# Altium schematic sheet EVB-NORA-B2_SCHEM_0000_Topsheet.SchDoc
size A3; Date: 7/24/2020; CompanyName: U-Blox; DrawnBy: EMOO; Engineer: EMOO; Organization: U-Blox; Address1: 3950 Fairview Industrial Dr SE #100; Address2: Salem, OR 97302; DocumentNumber: 1; SheetNumber: 1; SheetTotal: 8; SheetSize: B; SheetTitle: TopSheet
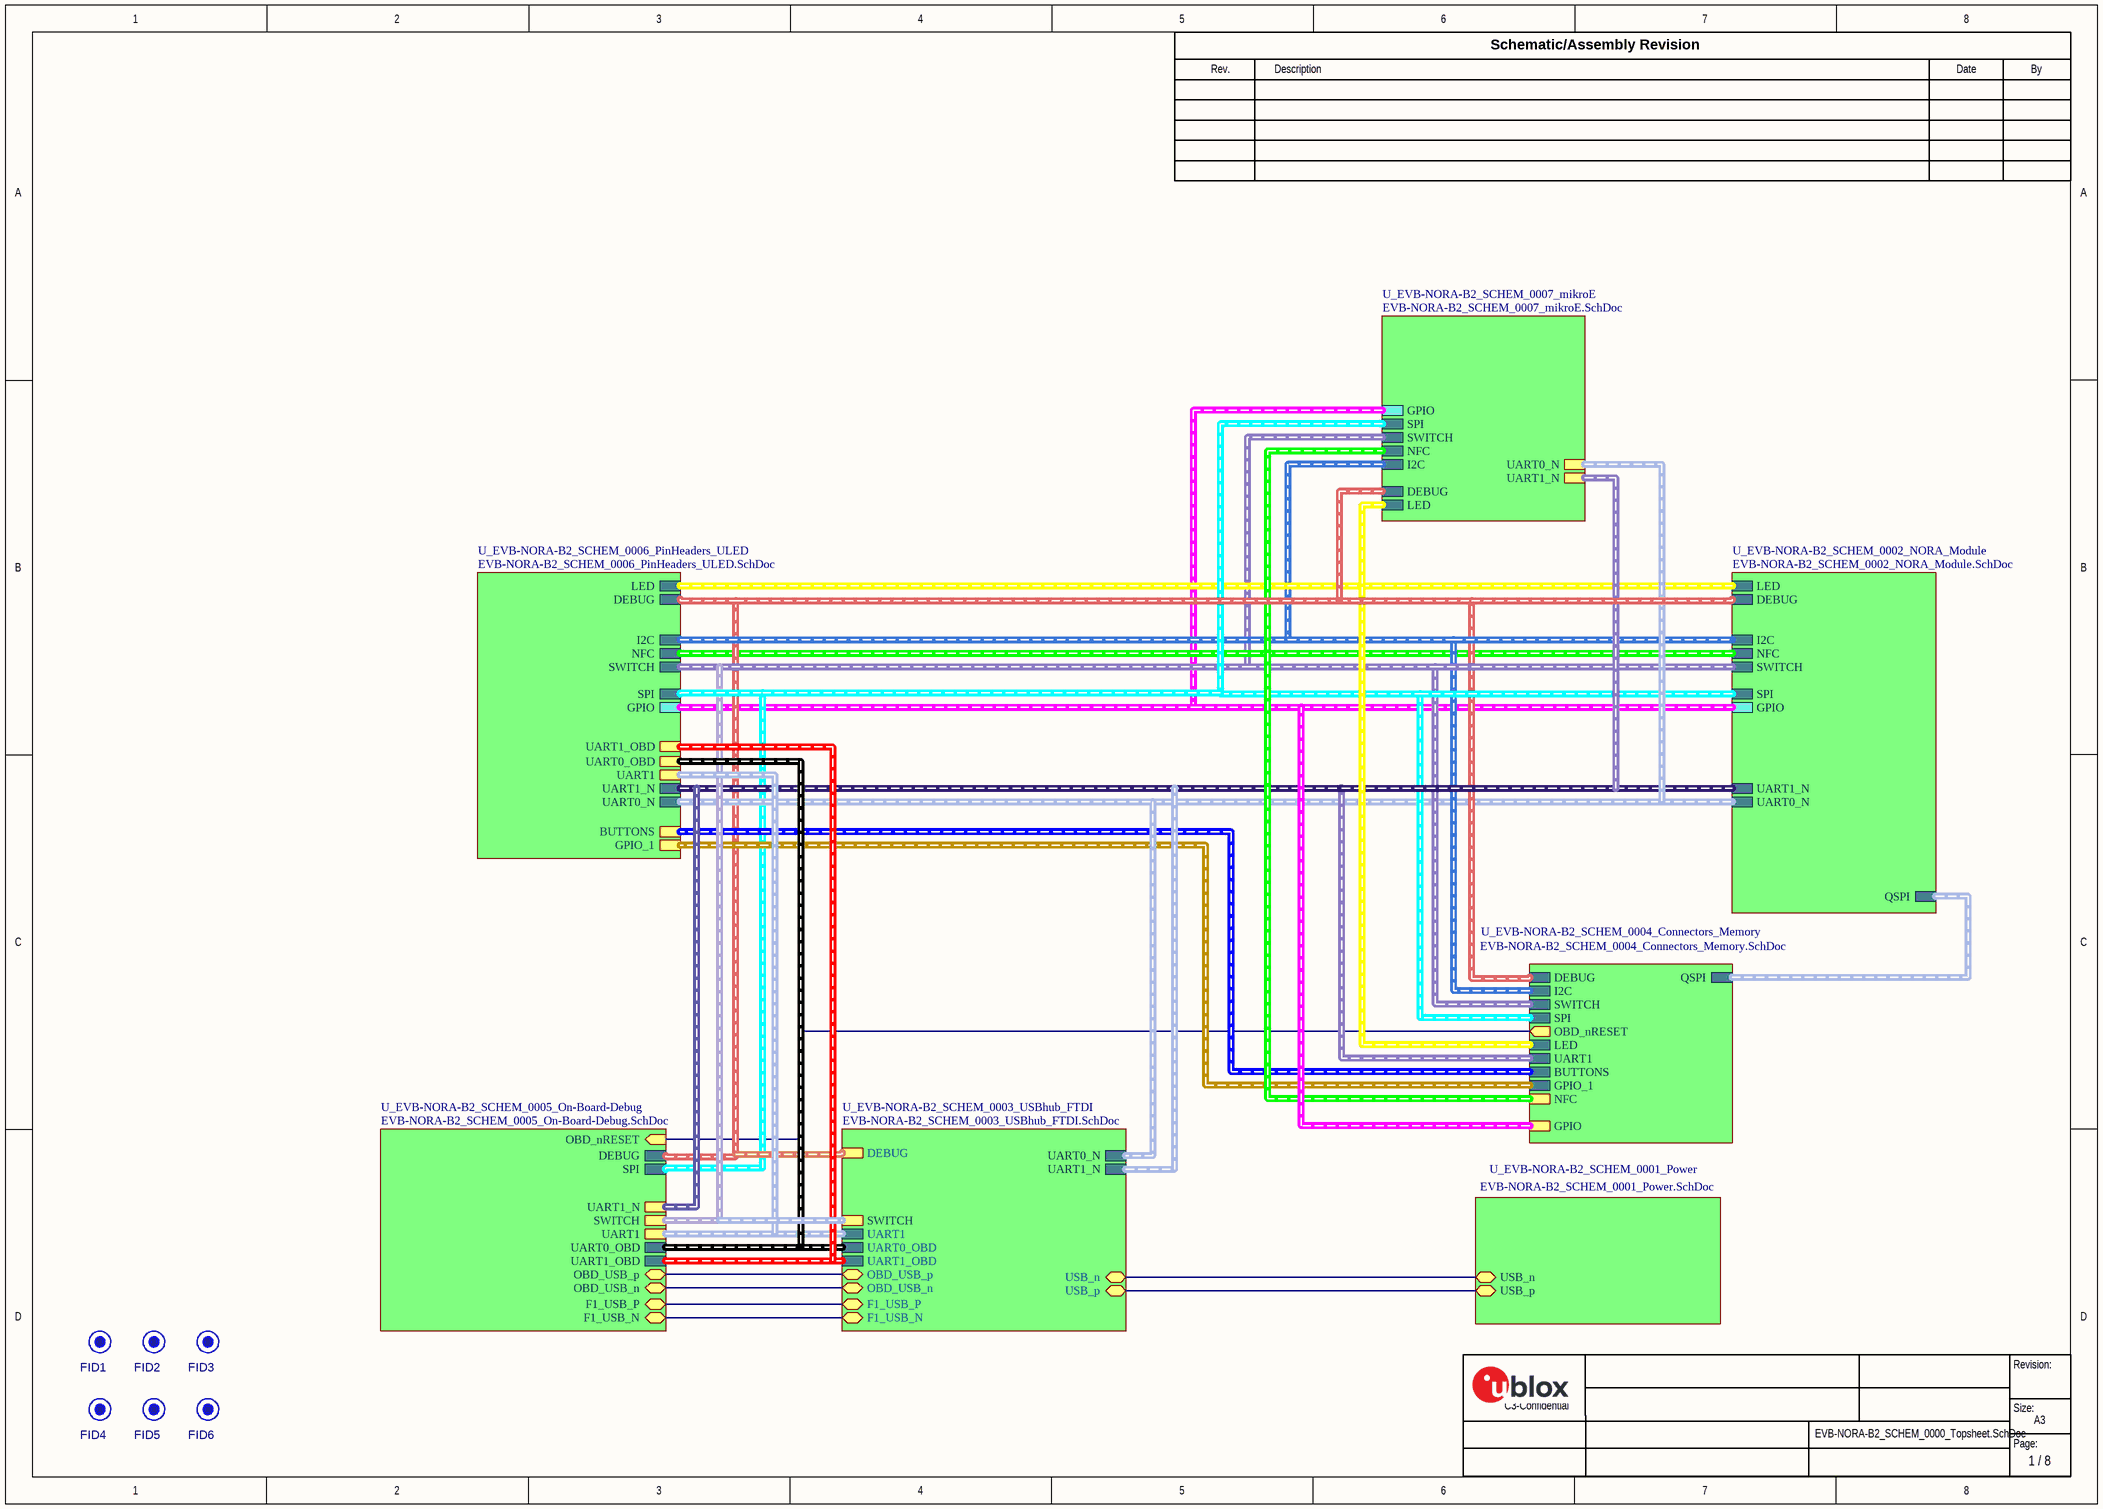
[diagram p0: EVB-NORA-B2_SCHEM_0000_Topsheet.SchDoc]

## Parts
FID1  FID  [FIDUCIAL40]  (value not drawn)  (no BOM)
FID2  FID  [FIDUCIAL40]  (value not drawn)  (no BOM)
FID3  FID  [FIDUCIAL40]  (value not drawn)  (no BOM)
FID4  FID  [FIDUCIAL40]  (value not drawn)  (no BOM)
FID5  FID  [FIDUCIAL40]  (value not drawn)  (no BOM)
FID6  FID  [FIDUCIAL40]  (value not drawn)  (no BOM)

## Sub-sheets
U_EVB-NORA-B2_SCHEM_0001_Power = EVB-NORA-B2_SCHEM_0001_Power.SchDoc: USB_n (bidir), USB_p (bidir)
U_EVB-NORA-B2_SCHEM_0002_NORA_Module = EVB-NORA-B2_SCHEM_0002_NORA_Module.SchDoc: LED (harness LED), DEBUG (harness Debug), UART1_N (harness UART1), I2C (harness I2C), NFC (harness NFC), SWITCH (harness SWITCH), UART0_N (harness UART0), QSPI (harness QSPI), SPI (harness SPI), GPIO (harness GPIO)
U_EVB-NORA-B2_SCHEM_0003_USBhub_FTDI = EVB-NORA-B2_SCHEM_0003_USBhub_FTDI.SchDoc: USB_n (bidir), USB_p (bidir), F1_USB_P (bidir), F1_USB_N (bidir), UART1 (harness UART-EXT), UART0_N (harness UART0), UART1_N (harness UART1), UART0_OBD (harness UART0_OBD), UART1_OBD (harness UART1_OBD), DEBUG (harness Debug), OBD_USB_n (bidir), OBD_USB_p (bidir), SWITCH (harness SWITCH)
U_EVB-NORA-B2_SCHEM_0004_Connectors_Memory = EVB-NORA-B2_SCHEM_0004_Connectors_Memory.SchDoc: DEBUG (harness Debug), I2C (harness I2C), SWITCH (harness SWITCH), QSPI (harness QSPI), SPI (harness SPI), LED (harness LED), UART1 (harness UART1), BUTTONS (harness BUTTONS), GPIO_1 (harness GP1O_1), OBD_nRESET (out), NFC (harness NFC), GPIO (harness GPIO)
U_EVB-NORA-B2_SCHEM_0005_On-Board-Debug = EVB-NORA-B2_SCHEM_0005_On-Board-Debug.SchDoc: F1_USB_P (bidir), F1_USB_N (bidir), UART0_OBD (harness UART0_OBD), UART1_OBD (harness UART1_OBD), DEBUG (harness Debug), SPI (harness SPI), OBD_nRESET (in), OBD_USB_p (bidir), OBD_USB_n (bidir), UART1 (harness UART1), SWITCH (harness SWITCH), UART1_N (harness UART1-NORA)
U_EVB-NORA-B2_SCHEM_0006_PinHeaders_ULED = EVB-NORA-B2_SCHEM_0006_PinHeaders_ULED.SchDoc: I2C (harness I2C), LED (harness LED), SWITCH (harness SWITCH), NFC (harness NFC), SPI (harness SPI), GPIO (harness GPIO), DEBUG (harness Debug), UART0_N (harness UART0), UART1_N (harness UART1), BUTTONS (harness BUTTONS), GPIO_1 (harness GP1O_1), UART1 (harness UART1), UART0_OBD (harness UART0_OBD), UART1_OBD (harness UART1_OBD)
U_EVB-NORA-B2_SCHEM_0007_mikroE = EVB-NORA-B2_SCHEM_0007_mikroE.SchDoc: I2C (harness I2C), LED (harness LED), SWITCH (harness SWITCH), NFC (harness NFC), DEBUG (harness Debug), SPI (harness SPI), GPIO (harness GPIO), UART0_N (harness UART0_NORA), UART1_N (harness UART1-NORA)

## Nets
(unnamed): sheet U_EVB-NORA-B2_SCHEM_0001_Power/USB_n, sheet U_EVB-NORA-B2_SCHEM_0003_USBhub_FTDI/USB_n
(unnamed): sheet U_EVB-NORA-B2_SCHEM_0001_Power/USB_p, sheet U_EVB-NORA-B2_SCHEM_0003_USBhub_FTDI/USB_p
(unnamed): sheet U_EVB-NORA-B2_SCHEM_0003_USBhub_FTDI/F1_USB_P, sheet U_EVB-NORA-B2_SCHEM_0005_On-Board-Debug/F1_USB_P
(unnamed): sheet U_EVB-NORA-B2_SCHEM_0003_USBhub_FTDI/F1_USB_N, sheet U_EVB-NORA-B2_SCHEM_0005_On-Board-Debug/F1_USB_N
(unnamed): sheet U_EVB-NORA-B2_SCHEM_0003_USBhub_FTDI/OBD_USB_n, sheet U_EVB-NORA-B2_SCHEM_0005_On-Board-Debug/OBD_USB_n
(unnamed): sheet U_EVB-NORA-B2_SCHEM_0003_USBhub_FTDI/OBD_USB_p, sheet U_EVB-NORA-B2_SCHEM_0005_On-Board-Debug/OBD_USB_p
(unnamed): sheet U_EVB-NORA-B2_SCHEM_0005_On-Board-Debug/OBD_nRESET, sheet U_EVB-NORA-B2_SCHEM_0004_Connectors_Memory/OBD_nRESET

## Buses and harness runs
harness sheet U_EVB-NORA-B2_SCHEM_0002_NORA_Module/DEBUG = sheet U_EVB-NORA-B2_SCHEM_0003_USBhub_FTDI/DEBUG = sheet U_EVB-NORA-B2_SCHEM_0004_Connectors_Memory/DEBUG = sheet U_EVB-NORA-B2_SCHEM_0005_On-Board-Debug/DEBUG = sheet U_EVB-NORA-B2_SCHEM_0006_PinHeaders_ULED/DEBUG = sheet U_EVB-NORA-B2_SCHEM_0007_mikroE/DEBUG
harness sheet U_EVB-NORA-B2_SCHEM_0002_NORA_Module/GPIO = sheet U_EVB-NORA-B2_SCHEM_0004_Connectors_Memory/GPIO = sheet U_EVB-NORA-B2_SCHEM_0006_PinHeaders_ULED/GPIO = sheet U_EVB-NORA-B2_SCHEM_0007_mikroE/GPIO
harness sheet U_EVB-NORA-B2_SCHEM_0002_NORA_Module/I2C = sheet U_EVB-NORA-B2_SCHEM_0004_Connectors_Memory/I2C = sheet U_EVB-NORA-B2_SCHEM_0006_PinHeaders_ULED/I2C = sheet U_EVB-NORA-B2_SCHEM_0007_mikroE/I2C
harness sheet U_EVB-NORA-B2_SCHEM_0002_NORA_Module/LED = sheet U_EVB-NORA-B2_SCHEM_0006_PinHeaders_ULED/LED
harness sheet U_EVB-NORA-B2_SCHEM_0002_NORA_Module/NFC = sheet U_EVB-NORA-B2_SCHEM_0006_PinHeaders_ULED/NFC
harness sheet U_EVB-NORA-B2_SCHEM_0002_NORA_Module/QSPI = sheet U_EVB-NORA-B2_SCHEM_0004_Connectors_Memory/QSPI
harness sheet U_EVB-NORA-B2_SCHEM_0002_NORA_Module/SPI = sheet U_EVB-NORA-B2_SCHEM_0004_Connectors_Memory/SPI = sheet U_EVB-NORA-B2_SCHEM_0005_On-Board-Debug/SPI = sheet U_EVB-NORA-B2_SCHEM_0006_PinHeaders_ULED/SPI = sheet U_EVB-NORA-B2_SCHEM_0007_mikroE/SPI
harness sheet U_EVB-NORA-B2_SCHEM_0002_NORA_Module/SWITCH = sheet U_EVB-NORA-B2_SCHEM_0003_USBhub_FTDI/SWITCH = sheet U_EVB-NORA-B2_SCHEM_0004_Connectors_Memory/SWITCH = sheet U_EVB-NORA-B2_SCHEM_0005_On-Board-Debug/SWITCH = sheet U_EVB-NORA-B2_SCHEM_0006_PinHeaders_ULED/SWITCH = sheet U_EVB-NORA-B2_SCHEM_0007_mikroE/SWITCH
harness sheet U_EVB-NORA-B2_SCHEM_0002_NORA_Module/UART0_N = sheet U_EVB-NORA-B2_SCHEM_0003_USBhub_FTDI/UART0_N = sheet U_EVB-NORA-B2_SCHEM_0006_PinHeaders_ULED/UART0_N = sheet U_EVB-NORA-B2_SCHEM_0007_mikroE/UART0_N
harness sheet U_EVB-NORA-B2_SCHEM_0002_NORA_Module/UART1_N = sheet U_EVB-NORA-B2_SCHEM_0003_USBhub_FTDI/UART1_N = sheet U_EVB-NORA-B2_SCHEM_0004_Connectors_Memory/UART1 = sheet U_EVB-NORA-B2_SCHEM_0005_On-Board-Debug/UART1_N = sheet U_EVB-NORA-B2_SCHEM_0006_PinHeaders_ULED/UART1_N = sheet U_EVB-NORA-B2_SCHEM_0007_mikroE/UART1_N
harness sheet U_EVB-NORA-B2_SCHEM_0003_USBhub_FTDI/UART0_OBD = sheet U_EVB-NORA-B2_SCHEM_0005_On-Board-Debug/UART0_OBD = sheet U_EVB-NORA-B2_SCHEM_0006_PinHeaders_ULED/UART0_OBD
harness sheet U_EVB-NORA-B2_SCHEM_0003_USBhub_FTDI/UART1 = sheet U_EVB-NORA-B2_SCHEM_0005_On-Board-Debug/UART1 = sheet U_EVB-NORA-B2_SCHEM_0006_PinHeaders_ULED/UART1
harness sheet U_EVB-NORA-B2_SCHEM_0003_USBhub_FTDI/UART1_OBD = sheet U_EVB-NORA-B2_SCHEM_0005_On-Board-Debug/UART1_OBD = sheet U_EVB-NORA-B2_SCHEM_0006_PinHeaders_ULED/UART1_OBD
harness sheet U_EVB-NORA-B2_SCHEM_0004_Connectors_Memory/BUTTONS = sheet U_EVB-NORA-B2_SCHEM_0006_PinHeaders_ULED/BUTTONS
harness sheet U_EVB-NORA-B2_SCHEM_0004_Connectors_Memory/GPIO_1 = sheet U_EVB-NORA-B2_SCHEM_0006_PinHeaders_ULED/GPIO_1
harness sheet U_EVB-NORA-B2_SCHEM_0004_Connectors_Memory/LED = sheet U_EVB-NORA-B2_SCHEM_0007_mikroE/LED
harness sheet U_EVB-NORA-B2_SCHEM_0004_Connectors_Memory/NFC = sheet U_EVB-NORA-B2_SCHEM_0007_mikroE/NFC

## Notes on the sheet
- Rev.
- Description
- Schematic/Assembly Revision
- Date
- By
- Revision:
- C3-Confidential
- Page:
- Size:
- A3

## Library data of the parts
FID1-FID6 = FIDUCIAL.04: Fiducial, 0.040" inner Dia, 0.075" outer Dia; Added By: Jeremy D; Part Number: FIDUCIAL.04; Size: 0.040"; Height: 0; DNP: DNP; Added Date: 2/1/2015; Checked By: Paul B; Checked Date: 2/5/2015